# Altium schematic sheet 最小系统.SchDoc
size A4
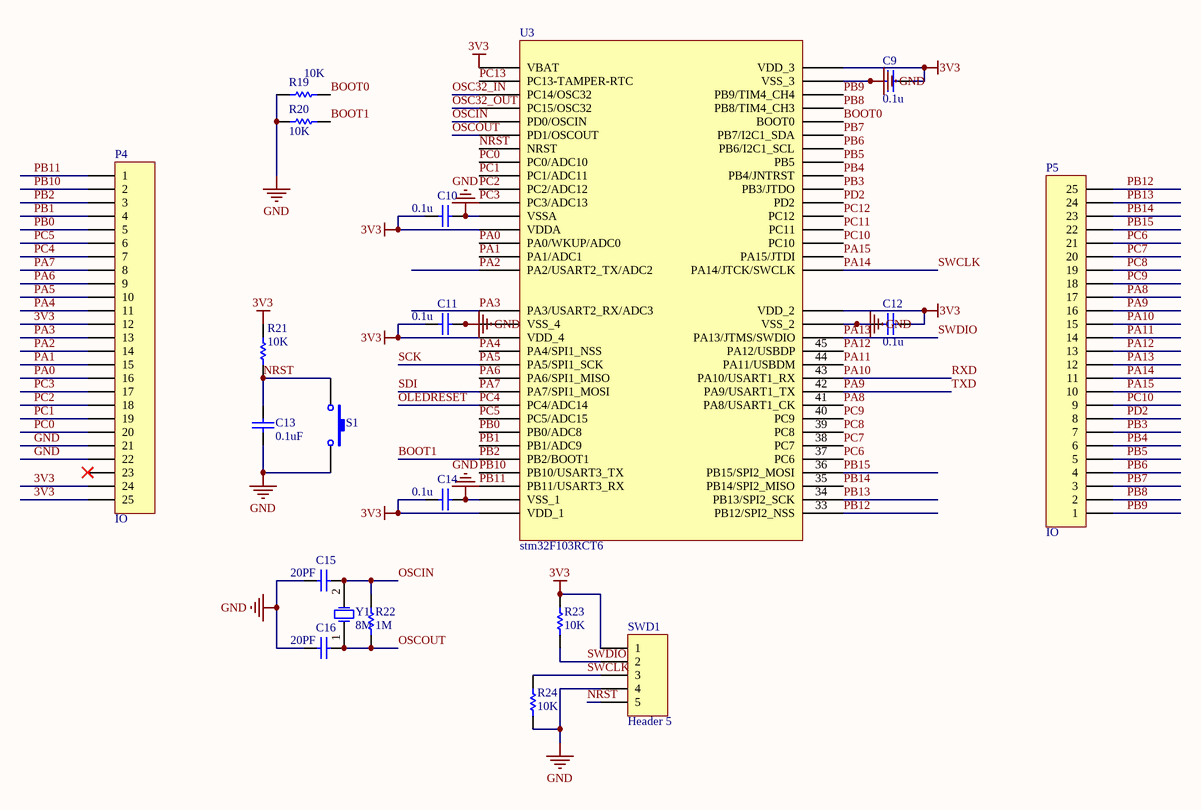
[diagram p0: 最小系统.SchDoc]

## Parts
C9  value 0.1u  [CAP-MLCC-0603]  (hidden comment: Cap)
C10  value 0.1u  [CAP-MLCC-0603]  (hidden comment: Cap)
C11  value 0.1u  [CAP-MLCC-0603]  (hidden comment: Cap)
C12  value 0.1u  [CAP-MLCC-0603]  (hidden comment: Cap)
C13  value 0.1uF  [CAP-MLCC-0603]  (hidden comment: Cap)
C14  value 0.1u  [CAP-MLCC-0603]  (hidden comment: Cap)
C15  value 20PF  [CAP-MLCC-0603]  (hidden comment: Cap)
C16  value 20PF  [CAP-MLCC-0603]  (hidden comment: Cap)
P4  IO  [Header 25]
P5  IO  [Header 25]
R19  value 10K  [RES-0603]  (hidden comment: Res1)
R20  value 10K  [RES-0603]  (hidden comment: Res1)
R21  value 10K  [RES-0603]  (hidden comment: Res1)
R22  value 1M  [RES-0603]  (hidden comment: Res1)
R23  value 10K  [RES-0603]  (hidden comment: Res1)
R24  value 10K  [RES-0603]  (hidden comment: Res1)
S1  SW-PB  [key - duplicate]  (value not drawn)
SWD1  Header 5  [HDR1X5]
U3  stm32F103RCT6  [STM32F103RCT6]
Y1  8M  [Osc-6032]

## Nets
3V3: C9.1 C10.1 C11.1 C12.1 C14.1 P4.12 P4.24 P4.25 R21.2 R23.2 SWD1.1 U3.1(VBAT) U3.13(VDDA) U3.19(VDD_4) U3.32(VDD_1) U3.48(VDD_2) U3.64(VDD_3)
GND: C9.2 C10.2 C11.2 C12.2 C13.2 C14.2 C15.1 C16.1 P4.21 P4.22 R19.2 R20.2 R24.2 S1.2 SWD1.4 U3.12(VSSA) U3.18(VSS_4) U3.31(VSS_1) U3.47(VSS_2) U3.63(VSS_3)
BOOT0: R19.1 U3.60(BOOT0)
BOOT1: P4.3 R20.1 U3.28(PB2/BOOT1)  [also labelled PB2]
NRST: C13.1 R21.1 S1.1 SWD1.5 U3.7(NRST)
OLEDRESET: P4.7 U3.24(PC4/ADC14)  [also labelled PC4]
OSC32_IN: U3.3(PC14/OSC32)
OSC32_OUT: U3.4(PC15/OSC32)
OSCIN: C15.2 R22.2 U3.5(PD0/OSCIN) Y1.2(OSC2)
OSCOUT: C16.2 R22.1 U3.6(PD1/OSCOUT) Y1.1(OSC1)
PA0: P4.16 U3.14(PA0/WKUP/ADC0)
PA1: P4.15 U3.15(PA1/ADC1)
PA2: P4.14 U3.16(PA2/USART2_TX/ADC2)
PA3: P4.13 U3.17(PA3/USART2_RX/ADC3)
PA4: P4.11 U3.20(PA4/SPI1_NSS)
PA5: P4.10 U3.21(PA5/SPI1_SCK)  [also labelled SCK]
PA6: P4.9 U3.22(PA6/SPI1_MISO)
PA7: P4.8 U3.23(PA7/SPI1_MOSI)  [also labelled SDI]
PA8: P5.17 U3.41(PA8/USART1_CK)
PA9: P5.16 U3.42(PA9/USART1_TX)  [also labelled TXD]
PA10: P5.15 U3.43(PA10/USART1_RX)  [also labelled RXD]
PA11: P5.14 U3.44(PA11/USBDM)
PA12: P5.13 U3.45(PA12/USBDP)
PA13: P5.12 R23.1 SWD1.2 U3.46(PA13/JTMS/SWDIO)  [also labelled SWDIO]
PA14: P5.11 R24.1 SWD1.3 U3.49(PA14/JTCK/SWCLK)  [also labelled SWCLK]
PA15: P5.10 U3.50(PA15/JTDI)
PB0: P4.5 U3.26(PB0/ADC8)
PB1: P4.4 U3.27(PB1/ADC9)
PB3: P5.7 U3.55(PB3/JTDO)
PB4: P5.6 U3.56(PB4/JNTRST)
PB5: P5.5 U3.57(PB5)
PB6: P5.4 U3.58(PB6/I2C1_SCL)
PB7: P5.3 U3.59(PB7/I2C1_SDA)
PB8: P5.2 U3.61(PB8/TIM4_CH3)
PB9: P5.1 U3.62(PB9/TIM4_CH4)
PB10: P4.2 U3.29(PB10/USART3_TX)
PB11: P4.1 U3.30(PB11/USART3_RX)
PB12: P5.25 U3.33(PB12/SPI2_NSS)
PB13: P5.24 U3.34(PB13/SPI2_SCK)
PB14: P5.23 U3.35(PB14/SPI2_MISO)
PB15: P5.22 U3.36(PB15/SPI2_MOSI)
PC0: P4.20 U3.8(PC0/ADC10)
PC1: P4.19 U3.9(PC1/ADC11)
PC2: P4.18 U3.10(PC2/ADC12)
PC3: P4.17 U3.11(PC3/ADC13)
PC5: P4.6 U3.25(PC5/ADC15)
PC6: P5.21 U3.37(PC6)
PC7: P5.20 U3.38(PC7)
PC8: P5.19 U3.39(PC8)
PC9: P5.18 U3.40(PC9)
PC10: P5.9 U3.51(PC10)
PC11: U3.52(PC11)
PC12: U3.53(PC12)
PC13: U3.2(PC13-TAMPER-RTC)
PD2: P5.8 U3.54(PD2)

Not connected (* = marked no-connect by the designer): P4 23*

## Library data of the parts
C9-C12 C14-C16 = Cap_1: Capacitor; Published: 8-Jun-2000; LatestRevisionDate: 17-Jul-2002; LatestRevisionNote: Re-released for DXP Platform.; PackageReference: RAD-0.3; Publisher: Altium Limited
C13 = Cap: Capacitor; Published: 8-Jun-2000; LatestRevisionDate: 17-Jul-2002; LatestRevisionNote: Re-released for DXP Platform.; PackageReference: RAD-0.3; Publisher: Altium Limited
P4 P5 = Header 25: Header, 25-Pin; LatestRevisionDate: 17-Jul-2002; LatestRevisionNote: Re-released for DXP Platform.; Publisher: Altium Limited
R19-R24 = Res1_1: Resistor; Published: 8-Jun-2000; LatestRevisionDate: 17-Jul-2002; LatestRevisionNote: Re-released for DXP Platform.; PackageReference: AXIAL-0.3; Publisher: Altium Limited
S1 = SW-PB: Switch; Published: 24-Mar-1999; LatestRevisionDate: 17-Jul-2002; LatestRevisionNote: Re-released for DXP Platform.; PackageReference: SPST-2; Publisher: Altium Limited; PackageDescription: Switch; 2 Leads
SWD1 = Header 5: Header, 5-Pin; LatestRevisionDate: 17-Jul-2002; LatestRevisionNote: Re-released for DXP Platform.; Publisher: Altium Limited
Y1 = C-Osc: Crystal Oscillator; Published: 8-Jun-2000; LatestRevisionDate: 17-Jul-2002; LatestRevisionNote: Re-released for DXP Platform.; PackageReference: R38; Publisher: Altium Limited; PackageDescription: Crystal, Thru-Hole; 2 Leads; Body 3.1 x 8.2 mm (Dia.xH)